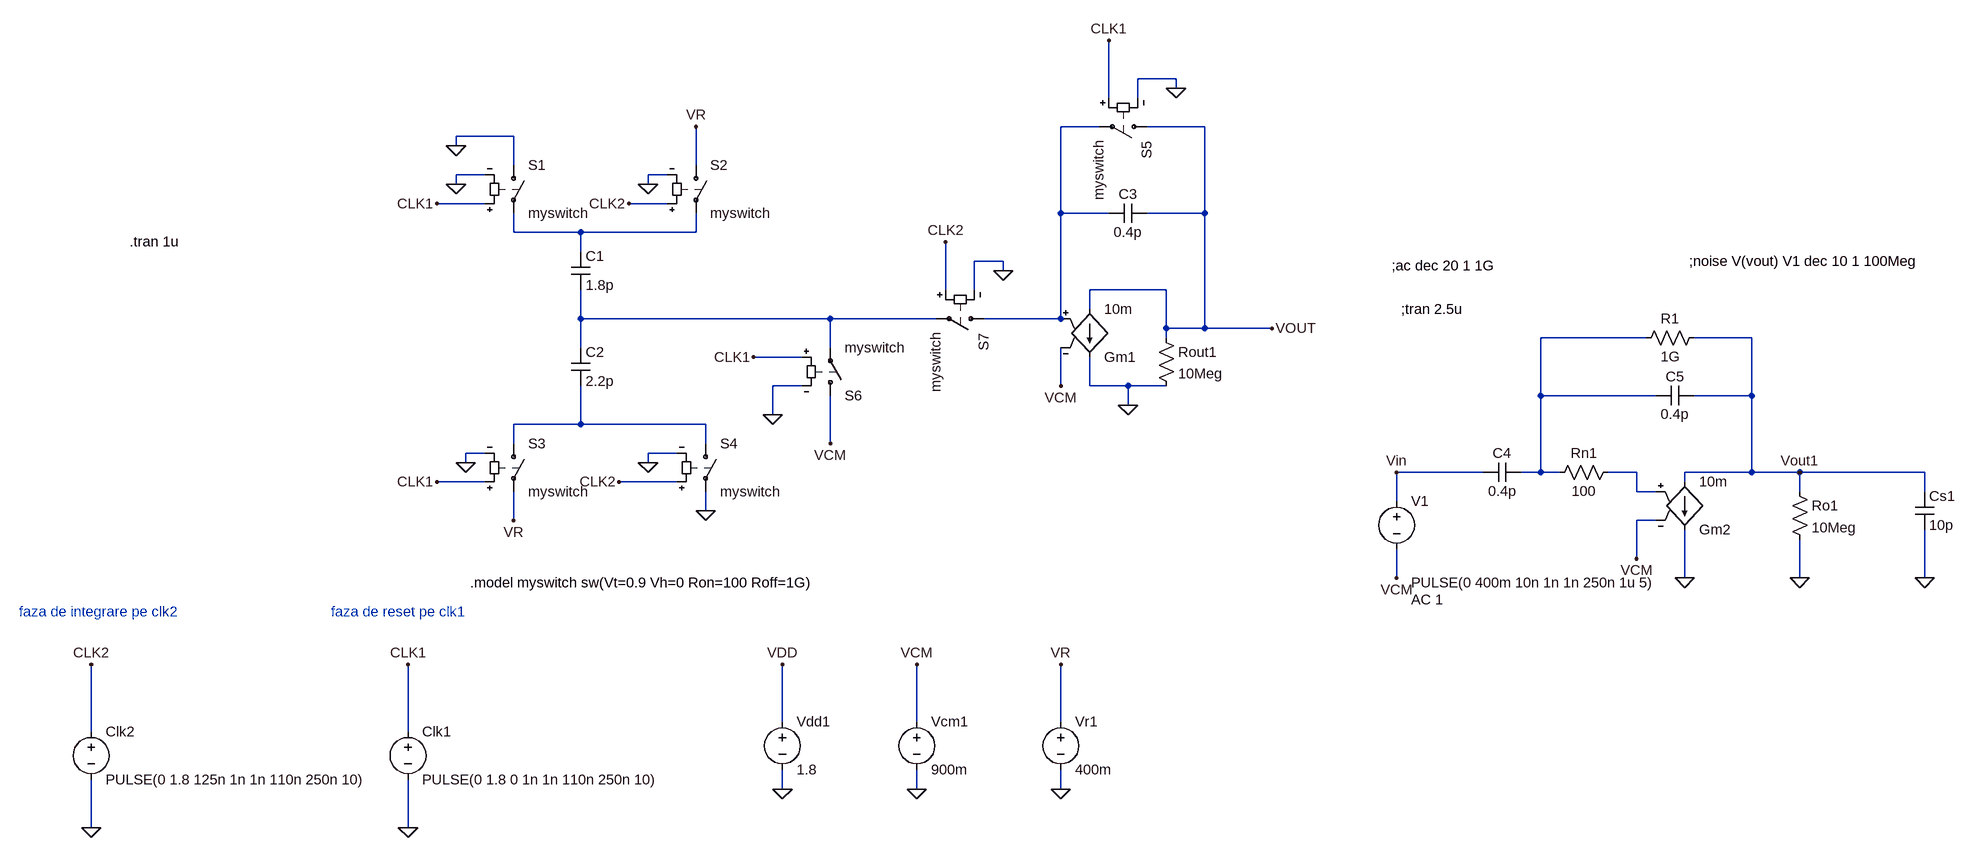
[diagram p0: schematic Draft1.asc]
Draft1.asc, the LTspice schematic file:
Version 4
SHEET 1 3048 1108
WIRE 1136 -160 1072 -160
WIRE 1136 -144 1136 -160
WIRE 1024 -128 1024 -224
WIRE 1072 -128 1072 -160
WIRE 1008 -80 944 -80
WIRE 1184 -80 1088 -80
WIRE 32 -64 -64 -64
WIRE -64 -48 -64 -64
WIRE 32 -16 32 -64
WIRE 336 -16 336 -80
WIRE -16 0 -64 0
WIRE 288 0 256 0
WIRE -64 16 -64 0
WIRE 256 16 256 0
WIRE -16 48 -96 48
WIRE 288 48 224 48
WIRE 944 64 944 -80
WIRE 1024 64 944 64
WIRE 1184 64 1184 -80
WIRE 1184 64 1088 64
WIRE 32 96 32 64
WIRE 144 96 32 96
WIRE 336 96 336 64
WIRE 336 96 144 96
WIRE 144 128 144 96
WIRE 848 144 800 144
WIRE 848 160 848 144
WIRE 752 192 752 112
WIRE 800 192 800 144
WIRE 1120 192 992 192
WIRE 992 224 992 192
WIRE 144 240 144 192
WIRE 560 240 144 240
WIRE 736 240 560 240
WIRE 944 240 944 64
WIRE 944 240 816 240
WIRE 1120 256 1120 192
WIRE 1184 256 1184 64
WIRE 1184 256 1120 256
WIRE 1296 256 1184 256
WIRE 1120 272 1120 256
WIRE 2528 272 2352 272
WIRE 2704 272 2608 272
WIRE 144 288 144 240
WIRE 560 288 560 240
WIRE 512 304 432 304
WIRE 512 352 464 352
WIRE 944 352 944 288
WIRE 992 352 992 304
WIRE 1056 352 992 352
WIRE 1120 352 1056 352
WIRE 2352 368 2352 272
WIRE 2544 368 2352 368
WIRE 2704 368 2704 272
WIRE 2704 368 2608 368
WIRE 1056 384 1056 352
WIRE 464 400 464 352
WIRE 144 416 144 352
WIRE 144 416 32 416
WIRE 352 416 144 416
WIRE 32 448 32 416
WIRE 352 448 352 416
WIRE 560 448 560 368
WIRE -16 464 -48 464
WIRE 304 464 256 464
WIRE -48 480 -48 464
WIRE 256 480 256 464
WIRE 2256 496 2112 496
WIRE 2352 496 2352 368
WIRE 2352 496 2320 496
WIRE 2384 496 2352 496
WIRE 2512 496 2464 496
WIRE 2704 496 2704 368
WIRE 2704 496 2592 496
WIRE 2784 496 2704 496
WIRE 2992 496 2784 496
WIRE -16 512 -96 512
WIRE 304 512 208 512
WIRE 2592 512 2592 496
WIRE 2512 528 2512 496
WIRE 2544 528 2512 528
WIRE 2784 528 2784 496
WIRE 2992 528 2992 496
WIRE 2112 544 2112 496
WIRE 352 560 352 528
WIRE 32 576 32 528
WIRE 2544 576 2512 576
WIRE 2512 640 2512 576
WIRE 2112 672 2112 624
WIRE 2592 672 2592 592
WIRE 2784 672 2784 608
WIRE 2992 672 2992 592
WIRE 480 912 480 816
WIRE 704 912 704 816
WIRE 944 912 944 816
WIRE -672 928 -672 816
WIRE -144 928 -144 816
WIRE 480 1024 480 992
WIRE 704 1024 704 992
WIRE 944 1024 944 992
WIRE -672 1088 -672 1008
WIRE -144 1088 -144 1008
FLAG 208 512 CLK2
FLAG 224 48 CLK2
FLAG -96 48 CLK1
FLAG -96 512 CLK1
FLAG -48 480 0
FLAG 256 480 0
FLAG 256 16 0
FLAG -64 16 0
FLAG -64 -48 0
FLAG 352 560 0
FLAG 32 576 VR
FLAG 336 -80 VR
FLAG -144 816 CLK1
FLAG -672 816 CLK2
FLAG -144 1088 0
FLAG -672 1088 0
FLAG 480 1024 0
FLAG 704 1024 0
FLAG 944 1024 0
FLAG 944 816 VR
FLAG 704 816 VCM
FLAG 480 816 VDD
FLAG 1296 256 VOUT
FLAG 1024 -224 CLK1
FLAG 1136 -144 0
FLAG 752 112 CLK2
FLAG 464 400 0
FLAG 432 304 CLK1
FLAG 560 448 VCM
FLAG 848 160 0
FLAG 1056 384 0
FLAG 944 352 VCM
FLAG 2592 672 0
FLAG 2512 640 VCM
FLAG 2112 672 VCM
FLAG 2784 672 0
FLAG 2784 496 Vout1
FLAG 2112 496 Vin
FLAG 2992 672 0
SYMBOL cap 128 128 R0
SYMATTR InstName C1
SYMATTR Value 1.8p
SYMBOL cap 128 288 R0
SYMATTR InstName C2
SYMATTR Value 2.2p
SYMBOL sw 32 -32 R0
SYMATTR InstName S1
SYMATTR Value myswitch
SYMBOL sw 336 -32 R0
SYMATTR InstName S2
SYMATTR Value myswitch
SYMBOL sw 32 432 R0
SYMATTR InstName S3
SYMATTR Value myswitch
SYMBOL sw 352 432 R0
SYMATTR InstName S4
SYMATTR Value myswitch
SYMBOL voltage -144 912 R0
WINDOW 123 0 0 Left 0
WINDOW 39 0 0 Left 0
SYMATTR InstName Clk1
SYMATTR Value PULSE(0 1.8 0 1n 1n 110n 250n 10)
SYMBOL voltage -672 912 R0
WINDOW 123 0 0 Left 0
WINDOW 39 0 0 Left 0
SYMATTR InstName Clk2
SYMATTR Value PULSE(0 1.8 125n 1n 1n 110n 250n 10)
SYMBOL voltage 704 896 R0
SYMATTR InstName Vcm1
SYMATTR Value 900m
SYMBOL voltage 944 896 R0
SYMATTR InstName Vr1
SYMATTR Value 400m
SYMBOL voltage 480 896 R0
SYMATTR InstName Vdd1
SYMATTR Value 1.8
SYMBOL cap 1088 48 R90
WINDOW 0 0 32 VBottom 2
WINDOW 3 32 32 VTop 2
SYMATTR InstName C3
SYMATTR Value 0.4p
SYMBOL sw 1104 -80 R90
SYMATTR InstName S5
SYMATTR Value myswitch
SYMBOL sw 560 384 M180
SYMATTR InstName S6
SYMATTR Value myswitch
SYMBOL sw 832 240 R90
SYMATTR InstName S7
SYMATTR Value myswitch
SYMBOL g2 992 320 M180
SYMATTR InstName Gm1
SYMATTR Value 10m
SYMBOL res 1104 256 R0
SYMATTR InstName Rout1
SYMATTR Value 10Meg
SYMBOL voltage 2112 528 R0
WINDOW 3 24 152 Left 2
WINDOW 123 24 180 Left 2
WINDOW 39 0 0 Left 0
SYMATTR Value PULSE(0 400m 10n 1n 1n 250n 1u 5)
SYMATTR Value2 AC 1
SYMATTR InstName V1
SYMBOL cap 2320 480 R90
WINDOW 0 0 32 VBottom 2
WINDOW 3 32 32 VTop 2
SYMATTR InstName C4
SYMATTR Value 0.4p
SYMBOL cap 2608 352 R90
WINDOW 0 0 32 VBottom 2
WINDOW 3 32 32 VTop 2
SYMATTR InstName C5
SYMATTR Value 0.4p
SYMBOL res 2480 480 R90
WINDOW 0 0 56 VBottom 2
WINDOW 3 32 56 VTop 2
SYMATTR InstName Rn1
SYMATTR Value 100
SYMBOL g2 2592 608 M180
SYMATTR InstName Gm2
SYMATTR Value 10m
SYMBOL res 2768 512 R0
SYMATTR InstName Ro1
SYMATTR Value 10Meg
SYMBOL res 2624 256 R90
WINDOW 0 0 56 VBottom 2
WINDOW 3 32 56 VTop 2
SYMATTR InstName R1
SYMATTR Value 1G
SYMBOL cap 2976 528 R0
SYMATTR InstName Cs1
SYMATTR Value 10p
TEXT -40 680 Left 2 !.model myswitch sw(Vt=0.9 Vh=0 Ron=100 Roff=1G)
TEXT -608 112 Left 2 !.tran 1u
TEXT -792 728 Left 2 ;faza de integrare pe clk2
TEXT -272 728 Left 2 ;faza de reset pe clk1
TEXT 2104 152 Left 2 !;ac dec 20 1 1G
TEXT 2120 224 Left 2 !;tran 2.5u
TEXT 2600 144 Left 2 !;noise V(vout) V1 dec 10 1 100Meg

The netlist it stands for:
* Draft1.asc
C1 N002 N003 1.8p
C2 N003 N005 2.2p
S1 0 N002 CLK1 0 myswitch
S2 VR N002 CLK2 0 myswitch
S3 N005 VR CLK1 0 myswitch
S4 N005 0 CLK2 0 myswitch
V§Clk1 CLK1 0 PULSE(0 1.8 0 1n 1n 110n 250n 10)
V§Clk2 CLK2 0 PULSE(0 1.8 125n 1n 1n 110n 250n 10)
Vcm1 VCM 0 900m
Vr1 VR 0 400m
Vdd1 VDD 0 1.8
C3 VOUT N001 0.4p
S5 VOUT N001 CLK1 0 myswitch
S6 VCM N003 CLK1 0 myswitch
S7 N001 N003 CLK2 0 myswitch
Gm1 VOUT 0 N001 VCM 10m
Rout1 VOUT 0 10Meg
V1 Vin VCM PULSE(0 400m 10n 1n 1n 250n 1u 5) AC 1
C4 N004 Vin 0.4p
C5 Vout1 N004 0.4p
Rn1 N006 N004 100
Gm2 Vout1 0 N006 VCM 10m
Ro1 Vout1 0 10Meg
R1 Vout1 N004 1G
Cs1 Vout1 0 10p
.model myswitch sw(Vt=0.9 Vh=0 Ron=100 Roff=1G)
.tran 1u
* faza de integrare pe clk2
* faza de reset pe clk1
;ac dec 20 1 1G
;tran 2.5u
;noise V(vout) V1 dec 10 1 100Meg
.backanno
.end